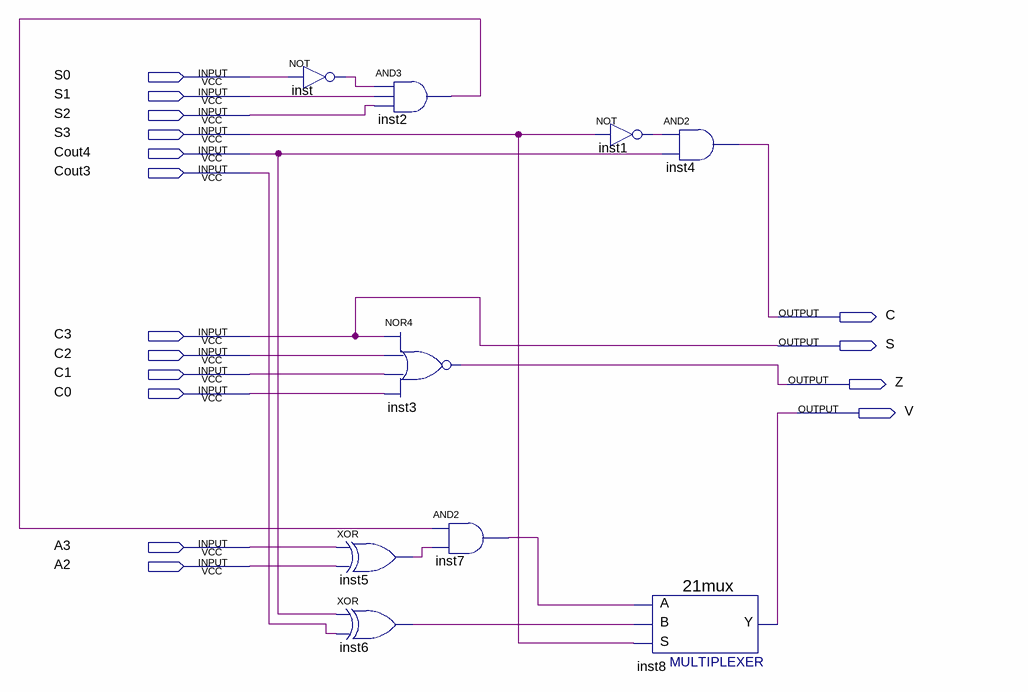
[diagram p0: schematic sheet]
// Quartus schematic StateBit Circuit.bdf as structural Verilog: 9 symbols, 16 pins
module \StateBit_Circuit  (
  input  S0,
  input  S1,
  input  S2,
  input  S3,
  input  Cout4,
  input  Cout3,
  input  C3,
  input  C2,
  input  C1,
  input  C0,
  input  A3,
  input  A2,
  output C,
  output S,
  output Z,
  output V
);

  wire inst1_out, inst2_out, inst5_out, inst6_out, inst7_out, inst_out;

  not inst (inst_out, S0);
  and inst2 (inst2_out, inst_out, S1, S2);
  nor inst3 (Z, C3, C2, C1, C0);
  xor inst5 (inst5_out, A3, A2);
  xor inst6 (inst6_out, Cout4, Cout3);
  and inst7 (inst7_out, inst2_out, inst5_out);
  not inst1 (inst1_out, S3);
  \21mux  inst8 (.S(S3), .B(inst6_out), .A(inst7_out), .Y(V));
  and inst4 (C, inst1_out, Cout4);

  assign S = C3;
endmodule
